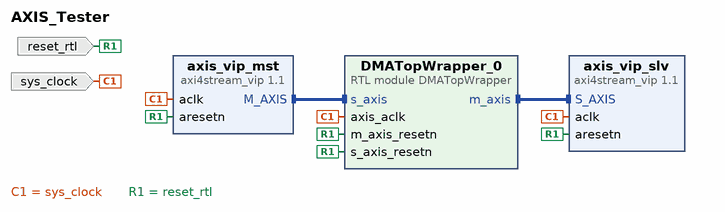
[diagram p0: block diagram of the top level]
# Vivado block design AXIS_Tester, xc7z020clg484-1, Vivado 2023.1.1
create_bd_design AXIS_Tester

create_bd_port -dir I -type clk sys_clock
set_property -dict {CONFIG.FREQ_HZ 100000000 CONFIG.PHASE 0.0} [get_bd_ports sys_clock]
create_bd_port -dir I -type rst reset_rtl
set_property -dict {CONFIG.POLARITY ACTIVE_LOW} [get_bd_ports reset_rtl]

create_bd_cell -type ip -vlnv xilinx.com:ip:axi4stream_vip:1.1 axis_vip_slv
set_property -dict {CONFIG.INTERFACE_MODE SLAVE} [get_bd_cells axis_vip_slv]
create_bd_cell -type ip -vlnv xilinx.com:ip:axi4stream_vip:1.1 axis_vip_mst
set_property -dict [list \
  CONFIG.HAS_TKEEP 0 \
  CONFIG.HAS_TLAST 1 \
  CONFIG.HAS_TREADY 1 \
  CONFIG.HAS_TSTRB 0 \
  CONFIG.INTERFACE_MODE MASTER \
  CONFIG.TDATA_NUM_BYTES 8 \
  CONFIG.TDEST_WIDTH 4 \
  CONFIG.TID_WIDTH 4 \
  CONFIG.TUSER_WIDTH 0 \
] [get_bd_cells axis_vip_mst]
create_bd_cell -type module -reference DMATopWrapper DMATopWrapper_0

# ---- connections ----

connect_bd_intf_net [get_bd_intf_pins DMATopWrapper_0/m_axis] [get_bd_intf_pins axis_vip_slv/S_AXIS]
connect_bd_intf_net -intf_net axi4stream_vip_1_M_AXIS [get_bd_intf_pins axis_vip_mst/M_AXIS] [get_bd_intf_pins DMATopWrapper_0/s_axis]
connect_bd_net -net clk_wiz_1_clk_out1 [get_bd_ports sys_clock] \
  [get_bd_pins axis_vip_mst/aclk] [get_bd_pins axis_vip_slv/aclk] [get_bd_pins DMATopWrapper_0/axis_aclk]
connect_bd_net [get_bd_ports reset_rtl] \
  [get_bd_pins axis_vip_mst/aresetn] [get_bd_pins axis_vip_slv/aresetn] [get_bd_pins DMATopWrapper_0/s_axis_resetn] \
  [get_bd_pins DMATopWrapper_0/m_axis_resetn]

validate_bd_design
save_bd_design
